# EAGLE schematic power-breakout (EAGLE 9.1.3)
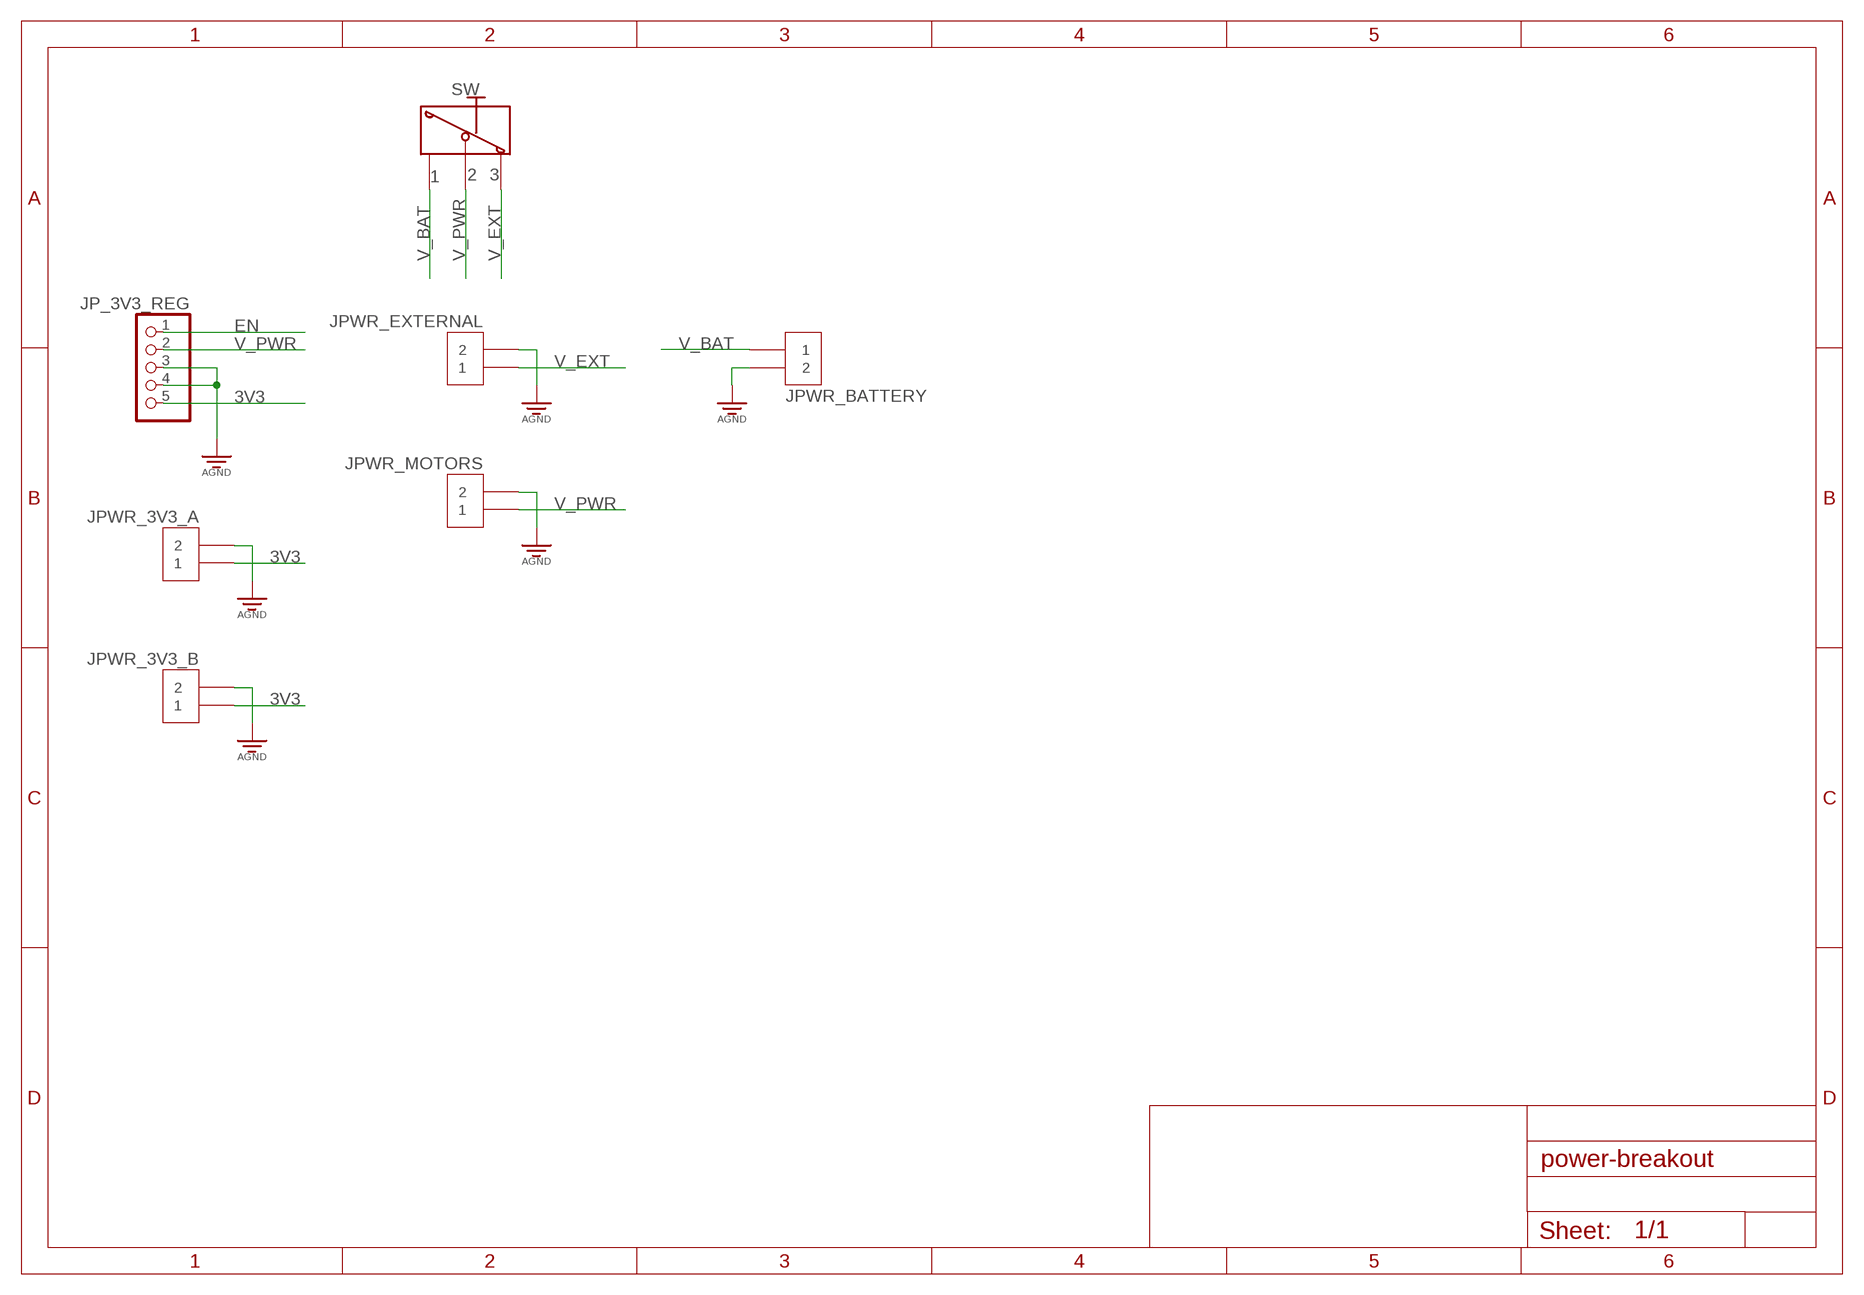
[diagram p0: schematic, sheet 1]

## Parts
JP_3V3_REG  CON-1X5  [1X05-CONNECTOR]
JPWR_3V3_A  WURTH_691103110002  [WURTH_691103110002]
JPWR_3V3_B  WURTH_691103110002  [WURTH_691103110002]
JPWR_BATTERY  WURTH_691103110002  [WURTH_691103110002]
JPWR_EXTERNAL  JST_B2P-VH_1X2_10A  [2_PINS,0.156_PITCH]
JPWR_MOTORS  WURTH_691103110002  [WURTH_691103110002]
SW  APEM_GH39P0  [APEM_GH39P0]

## Nets
3V3: JP_3V3_REG.5 JPWR_3V3_A.1 JPWR_3V3_B.1
AGND: JP_3V3_REG.3 JP_3V3_REG.4 JPWR_3V3_A.2 JPWR_3V3_B.2 JPWR_BATTERY.2 JPWR_EXTERNAL.2 JPWR_MOTORS.2
EN: JP_3V3_REG.1
V_BAT: JPWR_BATTERY.1 SW.P$1
V_EXT: JPWR_EXTERNAL.1 SW.P$3
V_PWR: JP_3V3_REG.2 JPWR_MOTORS.1 SW.P$2

## Library data of the parts
JP_3V3_REG = pin-headers:CON-1X5
JPWR_3V3_A JPWR_3V3_B JPWR_BATTERY JPWR_MOTORS = connectors-power:WURTH_691103110002
JPWR_EXTERNAL = connectors-power:JST_B2P-VH_1X2_10A
SW = switches:APEM_GH39P0